# EAGLE schematic Placa Versão Pseudo Final (EAGLE 9.2.2)
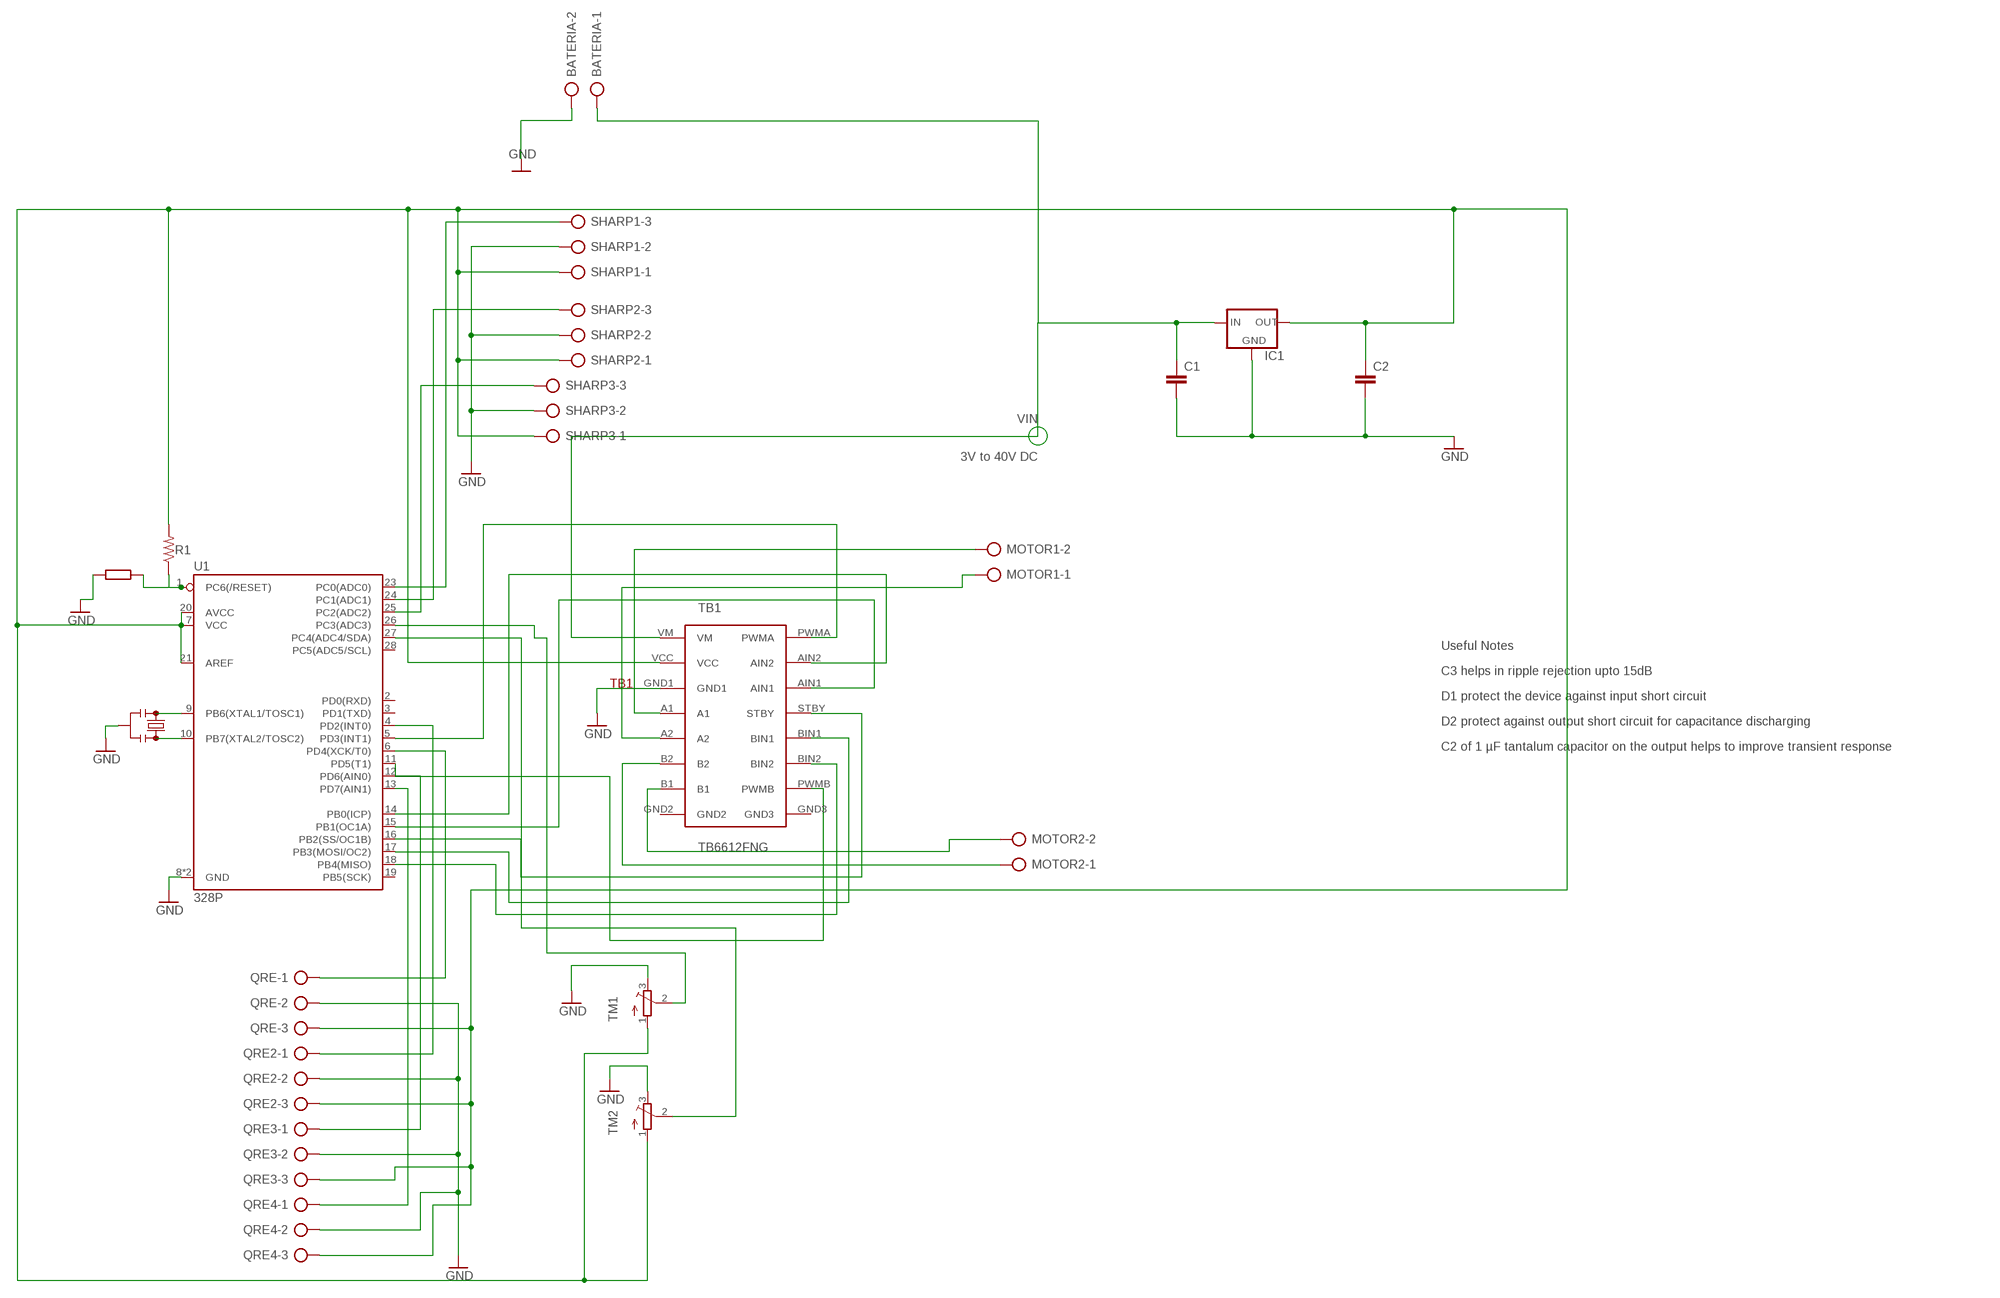
[diagram p0: schematic, sheet 1]

## Parts
BATERIA  AK500/2-H  [AK500/2-H]
C1  C5/3  [C5B3]
C2  C5/3  [C5B3]
IC1  78LXX  [78LXX]
MOTOR1  AK500/2-H  [AK500/2-H]
MOTOR2  AK500/2-H  [AK500/2-H]
QRE  AK500/3-H  [AK500/3-H]
QRE2  AK500/3-H  [AK500/3-H]
QRE3  AK500/3-H  [AK500/3-H]
QRE4  AK500/3-H  [AK500/3-H]
R1  R-US_0204/7  [0204/7]
SHARP1  AK500/3-H  [AK500/3-H]
SHARP2  AK500/3-H  [AK500/3-H]
SHARP3  AK500/3-H  [AK500/3-H]
TB1  TB6612FNG  [TB6612FNG]
TM1  TRIMPOT3386  [TRIM-3386]
TM2  TRIMPOT3386  [TRIM-3386]
U1  328P  ATMEGA328P_PDIP  [DIP28]
Y1  16MHz  RESONATOR-16MHZSMD_3.2X1.3  [RESONATOR-SMD-3.2X1.3]

## Nets
GND: BATERIA.2 C1.2 C2.2 IC1.GND QRE2.2 QRE3.2 QRE4.2 QRE.2 SHARP1.2 SHARP2.2 SHARP3.2 TB1.GND1 TM1.3(E) TM2.3(E) U1.8(GND) U1.22(GND) Y1.2
N$1: U1.9(PB6(XTAL1/TOSC1)) Y1.1
N$2: U1.10(PB7(XTAL2/TOSC2)) Y1.3
N$3: R1.1 U1.1(PC6(/RESET))
N$4: TB1.AIN2 U1.14(PB0(ICP))
N$5: TB1.AIN1 U1.15(PB1(OC1A))
N$6: MOTOR1.2 TB1.A1
N$7: MOTOR1.1 TB1.A2
N$8: MOTOR2.1 TB1.B2
N$9: MOTOR2.2 TB1.B1
N$10: TB1.PWMA U1.5(PD3(INT1))
N$11: TB1.STBY U1.16(PB2(SS/OC1B))
N$12: TB1.BIN1 U1.17(PB3(MOSI/OC2))
N$14: SHARP1.3 U1.23(PC0(ADC0))
N$15: SHARP2.3 U1.24(PC1(ADC1))
N$16: SHARP3.3 U1.25(PC2(ADC2))
N$17: QRE2.1 U1.4(PD2(INT0))
N$18: QRE4.1 U1.13(PD7(AIN1))
N$19: QRE3.1 U1.12(PD6(AIN0))
N$20: QRE.1 U1.6(PD4(XCK/T0))
N$21: TB1.BIN2 U1.18(PB4(MISO))
N$22: TB1.PWMB U1.11(PD5(T1))
N$23: TM2.2(S) U1.27(PC4(ADC4/SDA))
N$25: TM1.2(S) U1.26(PC3(ADC3))
VIN: BATERIA.1 C1.1 IC1.IN TB1.VM
VO: C2.1 IC1.OUT QRE2.3 QRE3.3 QRE4.3 QRE.3 R1.2 SHARP1.1 SHARP2.1 SHARP3.1 TB1.VCC TM1.1(A) TM2.1(A) U1.7(VCC) U1.20(AVCC) U1.21(AREF)
Unconnected: TB1.GND2 TB1.GND3 U1.2(PD0(RXD)) U1.3(PD1(TXD)) U1.19(PB5(SCK)) U1.28(PC5(ADC5/SCL))

## Notes on the sheet
- 3V to 40V DC
- Useful Notes
- C3 helps in ripple rejection upto 15dB
- D1 protect the device against input short circuit
- D2 protect against output short circuit for capacitance discharging
- C2 of 1 µF tantalum capacitor on the output helps to improve transient response

## Library data of the parts
BATERIA MOTOR1 MOTOR2 = con-ptr500:AK500/2-H: CONNECTOR Aug. 2004 / PTR Meßtechnik: Die Bezeichnung der Serie AK505 wurde geändert. Es handelt sich hierbei um AK500 in horizontaler Ausführung.; OC_FARNELL: unknown; OC_NEWARK: unknown
C1 C2 = capacitor-wima:C: CAPACITOR naming: grid - package width
IC1 = v-reg:78LXX: VOLTAGE REGULATOR
QRE QRE2-QRE4 SHARP1-SHARP3 = con-ptr500:AK500/3-H: CONNECTOR Aug. 2004 / PTR Meßtechnik: Die Bezeichnung der Serie AK505 wurde geändert. Es handelt sich hierbei um AK500 in horizontaler Ausführung.; OC_FARNELL: unknown; OC_NEWARK: unknown
R1 = resistor:R-US_: RESISTOR, American symbol
TB1 = TB6612FNG:TB6612FNG
TM1 TM2 = adafruit:TRIMPOT: SMT trimmer potentiometer part number TC33X http://www.ladyada.net/library/eagle
U1 = SparkFun-IC-Microcontroller:ATMEGA328P_PDIP: Atmel 328P Through hole ATMEGA328P uC used in the Arduino 32kb flash, 1k EEPROM, 2k SRAM Datasheet <http://www.sparkfun.com/datasheets/Components/SMD/ATMega328.pdf> SparkFun Products Storefront component: AVR 28 Pin 20MHz 32K 6A/D - ATMega328P <https://www.sparkfun.com/products/9061> (COM-09061) SparkFun Simon Says - Through-Hole Soldering Kit <https://www.sparkfun.com/products/10547> (KIT-10547) SparkFun Learn to Solder - Simon Says <https://www.sparkfun.com/products/13708> (KIT-13708) SparkFun BigTime Watch Kit <https://www.sparkfun.com/products/11734> (KIT-11734) SparkFun ClockIt <https://www.sparkfun.com/products/10930> (KIT-10930) SparkFun Serial Enabled LCD Kit <https://www.sparkfun.com/products/10097> (LCD-10097) SparkFun Simon Tilts - Through Hole Soldering Kit <https://www.sparkfun.com/products/12634> (KIT-12634) SparkFun Frequency Counter Kit <https://www.sparkfun.com/products/10140> (KIT-10140) FabFM Radio Kit <https://www.sparkfun.com/products/11043> (KIT-11043) SparkFun Binary Blaster Kit <https://www.sparkfun.com/products/12037> (KIT-12037) SparkFun Metro-Gnome <https://www.sparkfun.com/products/9236> (KIT-09236) ATmega328 with Arduino Optiboot (Uno) <https://www.sparkfun.com/products/10524> (DEV-10524); PROD_ID: IC-09136
Y1 = SparkFun-Clocks:RESONATOR-16MHZ: 16MHz Resonator Digikey Example <http://www.digikey.com/product-detail/en/murata-electronics-north-america/CSTCE16M0V53-R0/490-1198-1-ND/584635> Frequency: 16MHz Frequency Stability: ±0.3% Frequency Tolerance: ±0.5% Capacitance: 15pF SparkFun Products SparkFun OpenLog <https://www.sparkfun.com/products/13712> SparkFun MicroView - OLED Arduino Module <https://www.sparkfun.com/products/12923>; PROD_ID: XTAL-08900

## Net classes
0 default: clearance 0.205 mm
1 outer: width 0.61 mm